# Altium schematic sheet TPS63901_BuckBoost_lowIq_3V3_400mA.SchDoc
size A4; Organization: Arribada Initiative; Address1: https://github.com/arribada; Address2: contact@arribada.org; Address3: arribada.org; Address4: UK - Portsmouth; DocumentNumber: 4; SheetNumber: 4; SheetTotal: 5
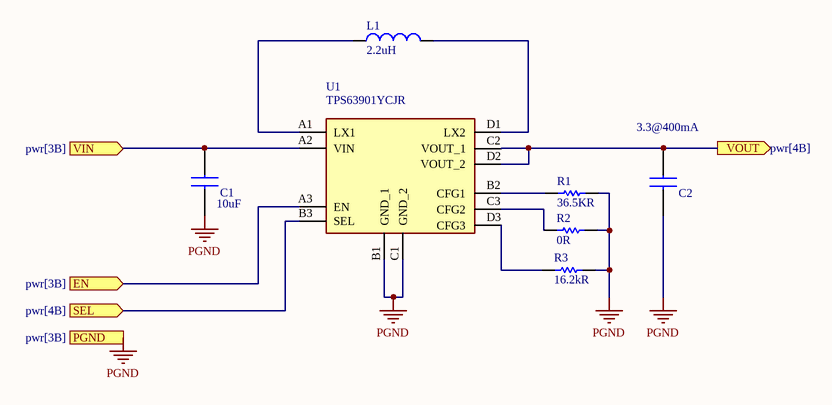
[diagram p0: TPS63901_BuckBoost_lowIq_3V3_400mA.SchDoc]

## Parts
C1  value 10uF  [CAPC1608X90N]  (hidden comment: GRM188R61A106MAALJ)
C2  GRM188R61A226ME15D  [GRM18x]  (value not drawn)
L1  value 2.2uH  [DFE2HCAH1R0MJ0L]  (hidden comment: DFE252012F-2R2M=P2)
R1  value 36.5KR  [RESC0603X28N]  (hidden comment: CRCW020136K5FNED)
R2  value 0R  [RESC0603X26N]  (hidden comment: RC0201FR-070RL)
R3  value 16.2kR  [ERJ1GN_(0201)]  (hidden comment: ERJ-1GNF1622C)
U1  TPS63901YCJR  [BGA12C35P3X4_111X146X35]

## Ports
EN (in, see pwr[3B]), PGND (in, see pwr[3B]), SEL (in, see pwr[4B]), VIN (in, see pwr[3B]), VOUT (out, see pwr[4B])

## Nets
PGND: C1.2 C2.2 R1.2 R2.2 R3.2 U1.B1(GND_1) U1.C1(GND_2) ; port PGND
EN: U1.A3(EN) ; port EN
SEL: U1.B3(SEL) ; port SEL
VIN: C1.1 U1.A2(VIN) ; port VIN
VOUT: C2.1 U1.C2(VOUT_1) U1.D2(VOUT_2) ; port VOUT
NetL1_1: L1.1 U1.A1(LX1)
NetL1_2: L1.2 U1.D1(LX2)
NetR1_1: R1.1 U1.B2(CFG1)
NetR2_1: R2.1 U1.C3(CFG2)
NetR3_1: R3.1 U1.D3(CFG3)

## Notes on the sheet
- (near C2) 3.3@400mA
- Title
- Size:
- Date:
- A4
- Reference:
- Time:
- Revision:
- Sheet
- of
- File:

## Library data of the parts
C1 = GRM188R61A106MAALJ: Multilayer Ceramic Capacitors MLCC - SMD/SMT 10 uF 10 VDC 20% 0603 X5R; Manufacturer_Name: Murata Electronics; Datasheet Link: https://psearch.en.murata.com/capacitor/product/GRM188R61A106MAAL%23.html; Height: 0.9mm; Manufacturer_Part_Number: GRM188R61A106MAALJ; Mouser Part Number: 81-GRM188R61A106MALJ; Mouser Price/Stock: https://www.mouser.co.uk/ProductDetail/Murata-Electronics/GRM188R61A106MAALJ?qs=hNud%2FORuBR0Lq8imX%2F1lYQ%3D%3D; Arrow Part Number: GRM188R61A106MAALJ; Arrow Price/Stock: https://www.arrow.com/en/products/grm188r61a106maalj/murata-manufacturing
C2 = GRM188R61A226ME15D: Multilayer Ceramic Capacitors MLCC - SMD/SMT 22 uF 10 VDC 20% 0603 X5R; Manufacturer_Name: Murata Electronics; Value: 22uF; Datasheet Link: https://search.murata.co.jp/Ceramy/image/img/A01X/G101/ENG/GRM188R61A226ME15-02A.pdf; Height: 0.8mm; Manufacturer_Part_Number: GRM188R61A226ME15D; Mouser Part Number: 81-GRM188R61A226ME5D; Mouser Price/Stock: https://www.mouser.co.uk/ProductDetail/Murata-Electronics/GRM188R61A226ME15D?qs=eeBpzGFlv%252B8DV%2FrilzyhAw%3D%3D; Arrow Part Number: GRM188R61A226ME15D; Arrow Price/Stock: https://www.arrow.com/en/products/grm188r61a226me15d/murata-manufacturing?region=nac
L1 = DFE252012F-2R2M=P2: Inductor Power Chip Shielded Wirewound 2.2uH 20% 1MHz Metal 2.3A 0.082Ohm DCR 1008 T/R; Manufacturer: Murata; Supplier 1: Mouser; Manufacturer Part Number: DFE252012F-2R2M=P2; RoHS: Yes; Category: Fixed Inductors; Stock 1: 84662; Pricing 1: 1=0,34, 10=0,221, 50=0,221, 100=0,208, 1000=0,208, 10000=0,176 (USD); ComponentLink1URL: http://www.farnell.com/datasheets/2616790.pdf?src-supplier=Farnell; ComponentLink1Description: http://www.farnell.com/datasheets/2616790.pdf?src-supplier=Farnell; ComponentLink2URL: https://www.murata.com/~/media/webrenewal/products/inductor/chip/tokoproducts/wirewoundmetalalloychiptype/m_dfe252012f.ashx?src-supplier=Digikey; ComponentLink2Description: https://www.murata.com/~/media/webrenewal/products/inductor/chip/tokoproducts/wirewoundmetalalloychiptype/m_dfe252012f.ashx?src-supplier=Digikey; ComponentLink3URL: https://datasheet.octopart.com/DFE252012F-2R2M%3DP2-Murata-datasheet-117010004.pdf?src-supplier=Future+Electronics; ComponentLink3Description: https://datasheet.octopart.com/DFE252012F-2R2M%3DP2-Murata-datasheet-117010004.pdf?src-supplier=Future+Electronics; ComponentLink4URL: https://datasheet.octopart.com/DFE252012F-2R2M%3DP2-Murata-datasheet-142691300.pdf?src-supplier=Arrow.cn; ComponentLink4Description: https://datasheet.octopart.com/DFE252012F-2R2M%3DP2-Murata-datasheet-142691300.pdf?src-supplier=Arrow.cn; Supplier Part Number 1: 81-DFE252012F-2R2MP2
R1 = CRCW020136K5FNED: Thick Film Resistors - SMD 36.5Kohm 1% 200ppm; Manufacturer_Name: Vishay; Datasheet Link: http://www.vishay.com/docs/20035/dcrcwe3.pdf; Height: 0.28mm; Manufacturer_Part_Number: CRCW020136K5FNED
R2 = RC0201FR-070RL: Thick Film Resistors - SMD 0 Ohms 50mW 0201 1%; Manufacturer_Name: KEMET; Datasheet Link: http://www.yageo.com/documents/recent/PYu-RC0201_51_RoHS_L_8.pdf; Height: 0.26mm; Manufacturer_Part_Number: RC0201FR-070RL; Mouser Part Number: 603-RC0201FR-070RL; Mouser Price/Stock: https://www.mouser.co.uk/ProductDetail/YAGEO/RC0201FR-070RL?qs=LWWr1WFOkdETHfAClQk8Xg%3D%3D; Arrow Part Number: RC0201FR-070RL; Arrow Price/Stock: https://www.arrow.com/en/products/rc0201fr-070rl/yageo?region=nac
R3 = ERJ-1GNF1622C: Thick Film Resistors - SMD 0201 16.2Kohm 1% HalogenFree AEC-Q200; Manufacturer_Name: Panasonic; Datasheet Link: https://industrial.panasonic.com/cdbs/www-data/pdf/RDA0000/AOA0000C301.pdf; Height: 0.26mm; Manufacturer_Part_Number: ERJ-1GNF1622C; Mouser Part Number: 667-ERJ-1GNF1622C; Mouser Price/Stock: https://www.mouser.co.uk/ProductDetail/Panasonic/ERJ-1GNF1622C?qs=nuXzIS8loXHV%2Fe0uV9zMuw%3D%3D
U1 = TPS63901YCJR: Integrated Circuit; Manufacturer_Name: Texas Instruments; Datasheet Link: https://www.ti.com/lit/ds/symlink/tps63901.pdf?ts=1658737279065&ref_url=https%253A%252F%252Fwww.ti.com%252Fproduct%252FTPS63901%253FkeyMatch%253DTPS63901YCJR%2526tisearch%253Dsearch-everything%2526usecase%253DOPN; Height: 0.35mm; Manufacturer_Part_Number: TPS63901YCJR; Mouser Part Number: 595-TPS63901YCJR; Mouser Price/Stock: https://www.mouser.co.uk/ProductDetail/Texas-Instruments/TPS63901YCJR?qs=vvQtp7zwQdNZy3FE2e2hqg%3D%3D; Arrow Part Number: TPS63901YCJR; Arrow Price/Stock: https://www.arrow.com/en/products/tps63901ycjr/texas-instruments?region=nac